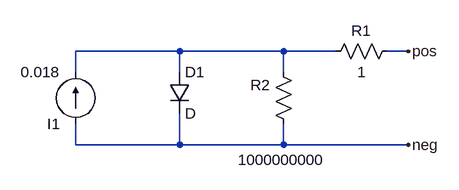
[diagram p0: schematic solarcellsymbol.asc]
solarcellsymbol.asc, the LTspice schematic file:
Version 4
SHEET 1 880 680
WIRE 32 80 -128 80
WIRE 192 80 32 80
WIRE 272 80 192 80
WIRE 384 80 352 80
WIRE -128 112 -128 80
WIRE 32 112 32 80
WIRE 192 112 192 80
WIRE -128 224 -128 192
WIRE 32 224 32 176
WIRE 32 224 -128 224
WIRE 192 224 192 192
WIRE 192 224 32 224
WIRE 384 224 192 224
FLAG 384 80 pos
FLAG 384 224 neg
SYMBOL current -128 192 R180
WINDOW 123 0 0 Left 0
WINDOW 39 0 0 Left 0
SYMATTR InstName I1
SYMATTR Value 0.018
SYMBOL diode 16 112 R0
SYMATTR InstName D1
SYMBOL res 368 64 R90
WINDOW 0 0 56 VBottom 2
WINDOW 3 32 56 VTop 2
SYMATTR InstName R1
SYMATTR Value 1
SYMBOL res 208 208 R180
WINDOW 0 36 76 Left 2
WINDOW 3 -49 -39 Left 2
SYMATTR InstName R2
SYMATTR Value 1000000000

The netlist it stands for:
* solarcellsymbol.asc
I1 neg N001 0.018
D1 N001 neg D
R1 pos N001 1
R2 neg N001 1000000000
.model D D
.lib standard.dio
.backanno
.end